# Altium schematic sheet VREG_5V.SchDoc
size A4
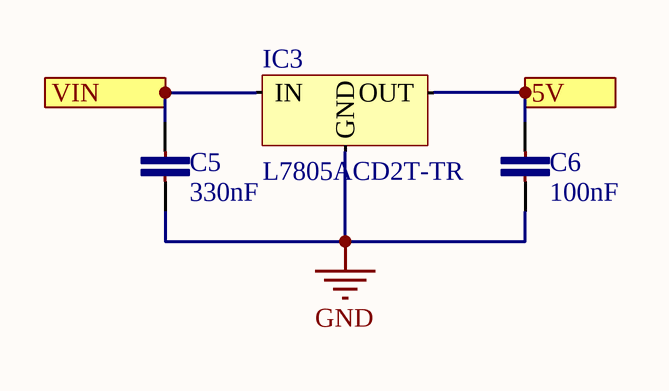
[diagram p0: VREG_5V.SchDoc]

## Parts
C5  330nF
C6  100nF  [CAP CER 0603]
IC3  L7805ACD2T-TR

## Ports
5V (out), VIN (in)

## Nets
GND: C5.2 C6.2 IC3.2(GND)
5V: C6.1 IC3.3(OUT) ; port 5V
VIN: C5.1 IC3.1(IN) ; port VIN

## Library data of the parts
C5 = CAP CER 0603 25V 330nF: Multilayer Ceramic Capacitors MLCC - SMD/SMT 0603 25VDC 0.33uF 10% X5R 0.8mm; Mfr Nr: C1608X5R1E334K080AC; Mfr: TDK; Voltage Rating: 25V; Type: Ceramic Capacitor; Dimensions: 0603 (1608 metric); Value: 330nF; Series: C
C6 = CAP CER 0603 25V 100nF: Multilayer Ceramic Capacitors MLCC - SMD/SMT 25V 0.1uF 0603 Y5V -20/+80%; Mfr Nr: C0603C104Z3VACTU; Mfr: KEMET; Type: Ceramic Capacitor; Dimensions: 0603 (1608 metric); Voltage Rating: 25V; Series: SMD Comm Y5V; Value: 100nF
IC3 = L7805ACD2T-TR: Linear Voltage Regulators 5.0V 1.0A Positive; Mfr: STMicroelectronics; Package: D2PAK; Series: L78